# Altium project NG2092_R0M0E0.PrjPcb (part 6 of 8)

## Sheet NG2092_LEVEL_SHIFT.SchDoc: =project_title
size Tabloid; CompanyName: Luxonis Holding; DrawnBy: Nejc Gostincar; Organization: Luxonis Holding; Address1: 1925 Harmony Park Drive; Address2: Westminster, CO; Address3: 80234; Address4: United States; DocumentNumber: DXXXX; Revision: R0M0E0; SheetNumber: 12; SheetTotal: 12
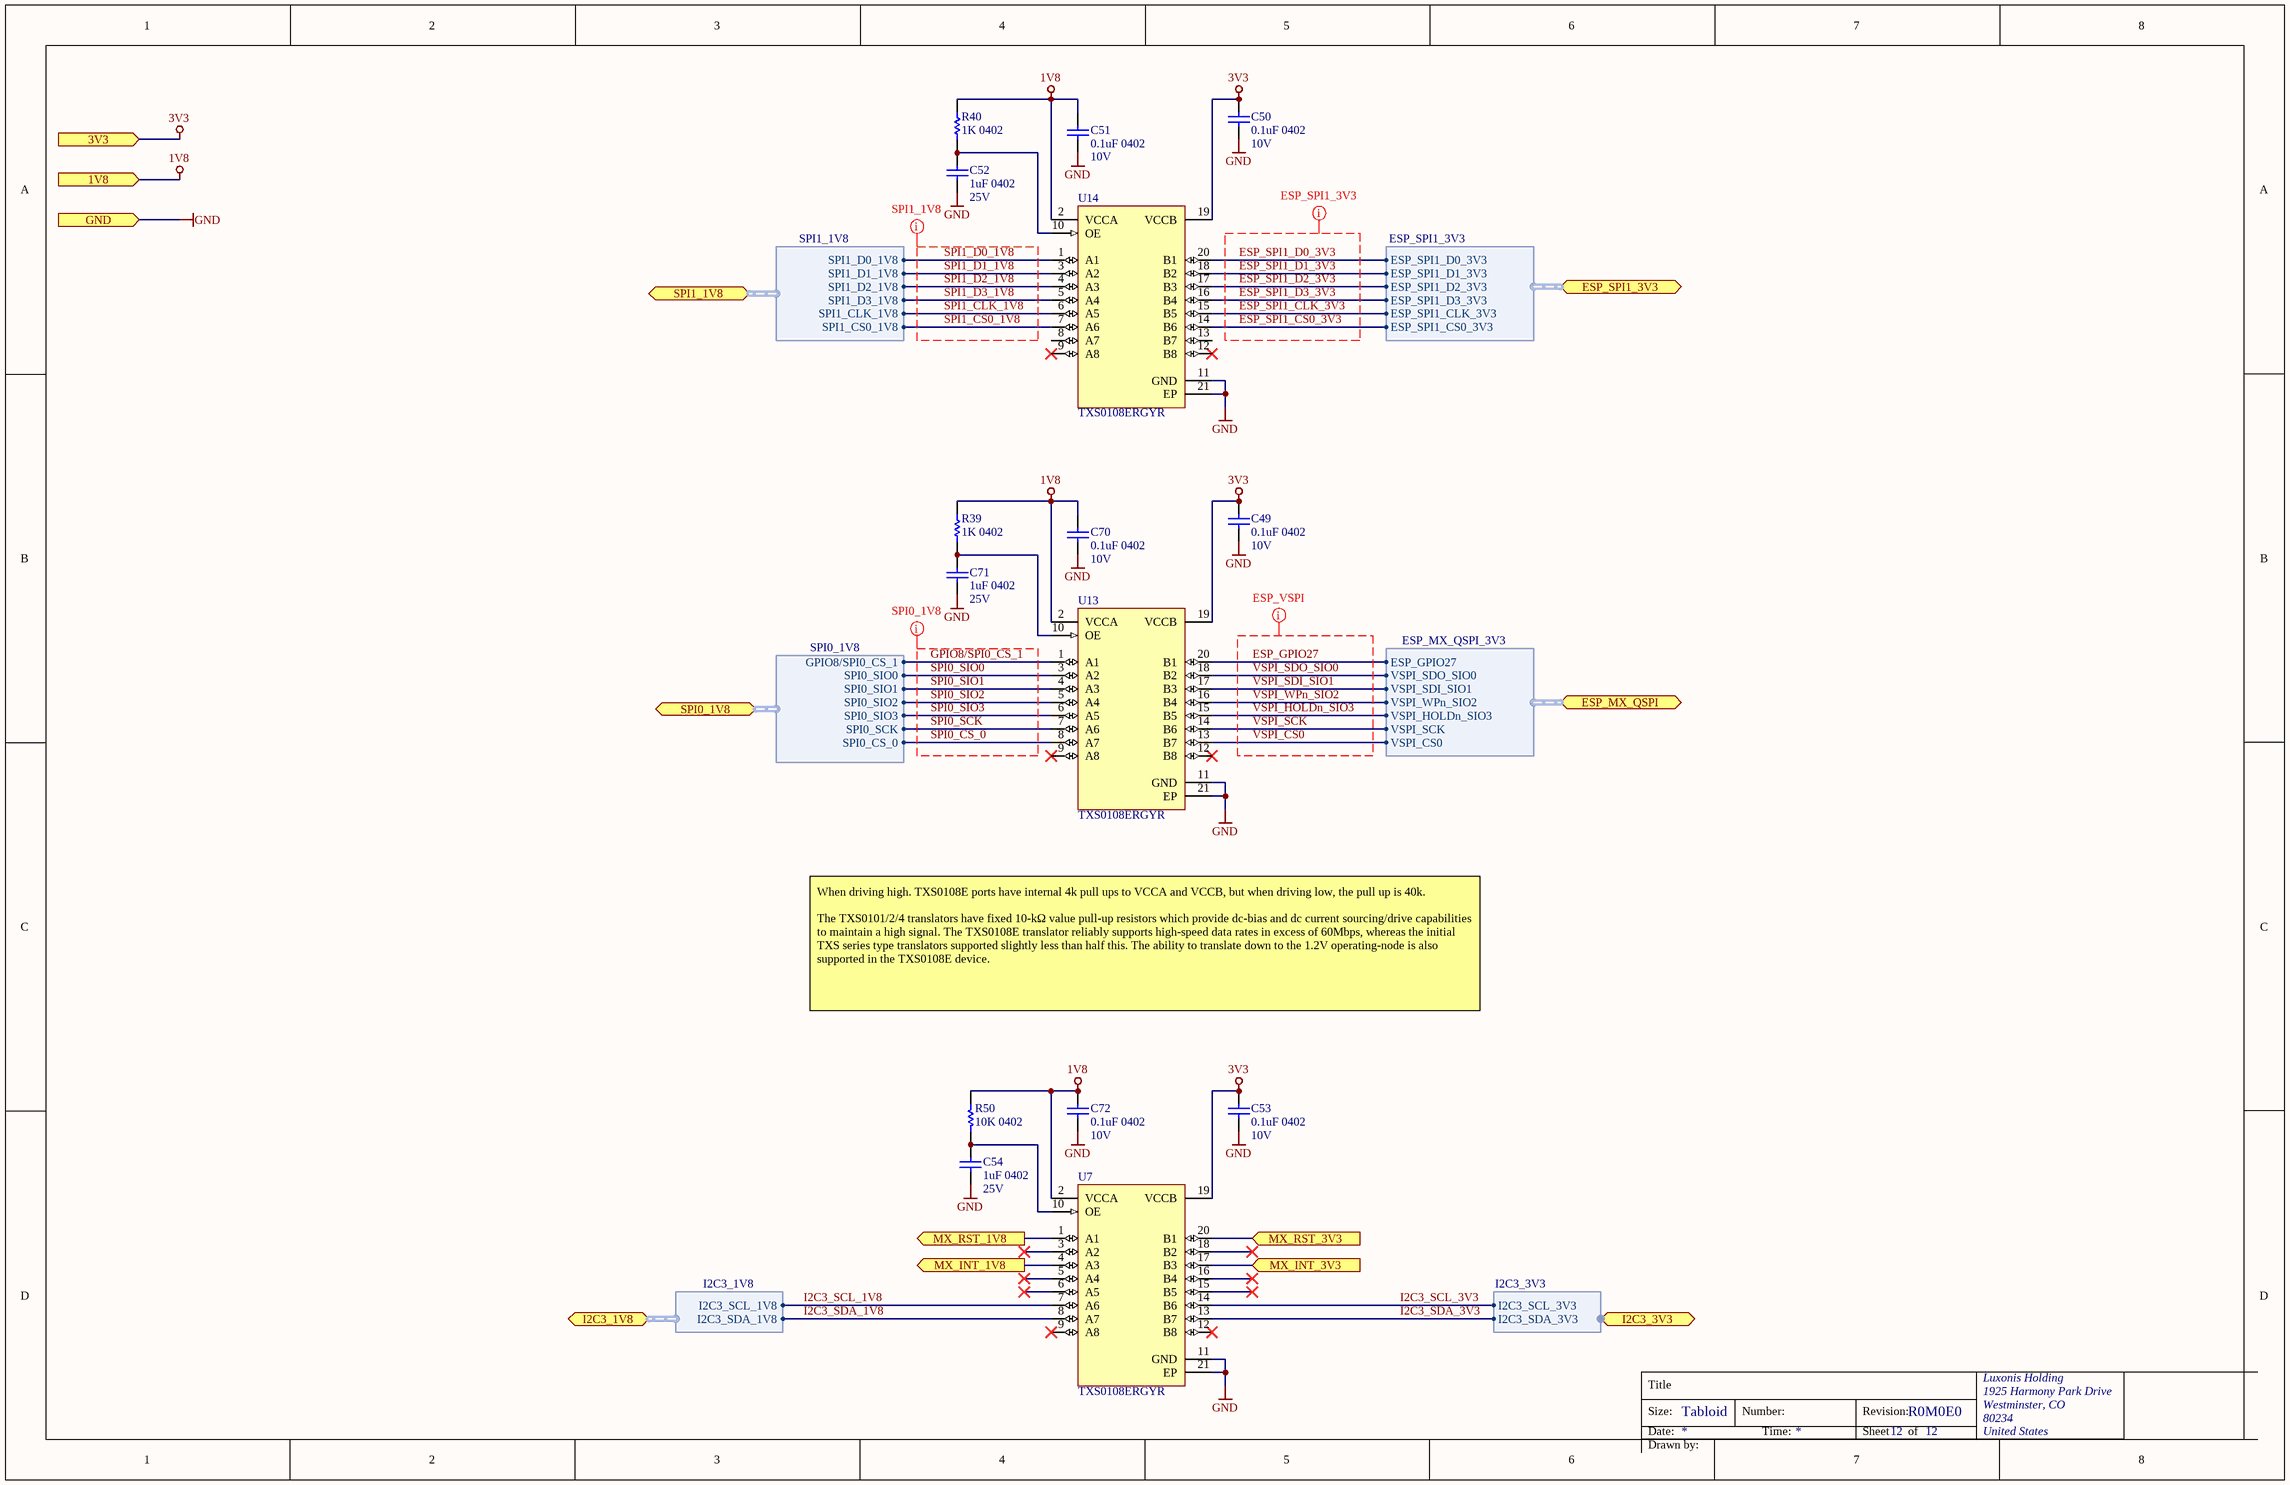
[diagram p11: NG2092_LEVEL_SHIFT.SchDoc]

### Parts
C49  0.1uF 0402  Voltage Rating: 10V  [CAPC0402(1005)70_L]
C50  0.1uF 0402  Voltage Rating: 10V  [CAPC0402(1005)70_L]
C51  0.1uF 0402  Voltage Rating: 10V  [CAPC0402(1005)70_L]
C52  1uF 0402  Voltage Rating: 25V  [CAPC0402(1005)70_N]
C53  0.1uF 0402  Voltage Rating: 10V  [CAPC0402(1005)70_L]
C54  1uF 0402  Voltage Rating: 25V  [CAPC0402(1005)70_N]
C70  0.1uF 0402  Voltage Rating: 10V  [CAPC0402(1005)70_L]
C71  1uF 0402  Voltage Rating: 25V  [CAPC0402(1005)70_N]
C72  0.1uF 0402  Voltage Rating: 10V  [CAPC0402(1005)70_L]
R39  1K 0402  [RESC0402(1005)_L]
R40  1K 0402  [RESC0402(1005)_L]
R50  10K 0402  [RESC0402(1005)_L]
U7  TXS0108ERGYR  [TXS0108ERGYR]
U13  TXS0108ERGYR  [TXS0108ERGYR]
U14  TXS0108ERGYR  [TXS0108ERGYR]

### Ports
1V8 (in), 3V3 (in), ESP_MX_QSPI (bidir, harness ESP_MX_QSPI_3V3), ESP_SPI1_3V3 (bidir, harness ESP_SPI1_3V3), GND (in), I2C3_1V8 (bidir, harness I2C3_1V8), I2C3_3V3 (bidir, harness I2C3_3V3), MX_INT_1V8 (out), MX_INT_3V3 (in), MX_RST_1V8 (out), MX_RST_3V3 (in), SPI0_1V8 (bidir, harness SPI0_1V8), SPI1_1V8 (bidir, harness SPI1_1V8)

### Harnesses
I2C3_3V3: I2C3_SCL_3V3, I2C3_SDA_3V3
ESP_MX_QSPI_3V3: VSPI_CS0, VSPI_HOLDn_SIO3, VSPI_SCK, VSPI_SDI_SIO1, VSPI_SDO_SIO0, VSPI_WPn_SIO2, ESP_GPIO27
SPI0_1V8: SPI0_SIO1, SPI0_SIO2, SPI0_SIO3, GPIO8/SPI0_CS_1, SPI0_SIO0, SPI0_CS_0, SPI0_SCK
I2C3_1V8: I2C3_SCL_1V8, I2C3_SDA_1V8
ESP_SPI1_3V3: ESP_SPI1_D0_3V3, ESP_SPI1_D1_3V3, ESP_SPI1_D2_3V3, ESP_SPI1_D3_3V3, ESP_SPI1_CLK_3V3, ESP_SPI1_CS0_3V3
SPI1_1V8: SPI1_D0_1V8, SPI1_D1_1V8, SPI1_D2_1V8, SPI1_D3_1V8, SPI1_CLK_1V8, SPI1_CS0_1V8

### Nets
1V8: C51.2 C70.2 C72.2 R39.2 R40.2 R50.1 U7.2(VCCA) U13.2(VCCA) U14.2(VCCA) ; port 1V8
3V3: C49.2 C50.2 C53.2 U7.19(VCCB) U13.19(VCCB) U14.19(VCCB) ; port 3V3
GND: C49.1 C50.1 C51.1 C52.1 C53.1 C54.1 C70.1 C71.1 C72.1 U7.11(GND) U7.21(EP) U13.11(GND) U13.21(EP) U14.11(GND) U14.21(EP) ; port GND
ESP_GPIO27: U13.20(B1) ; port ESP_MX_QSPI.ESP_GPIO27
ESP_SPI1_CLK_3V3: U14.15(B5) ; port ESP_SPI1_3V3.ESP_SPI1_CLK_3V3  [project net ESP_GPIO14_CLK]
ESP_SPI1_CS0_3V3: U14.14(B6) ; port ESP_SPI1_3V3.ESP_SPI1_CS0_3V3  [project net ESP_GPIO15_CS0]
ESP_SPI1_D0_3V3: U14.20(B1) ; port ESP_SPI1_3V3.ESP_SPI1_D0_3V3  [project net ESP_GPIO2_D0]
ESP_SPI1_D1_3V3: U14.18(B2) ; port ESP_SPI1_3V3.ESP_SPI1_D1_3V3  [project net ESP_GPIO4_D1]
ESP_SPI1_D2_3V3: U14.17(B3) ; port ESP_SPI1_3V3.ESP_SPI1_D2_3V3  [project net ESP_GPIO12_D2]
ESP_SPI1_D3_3V3: U14.16(B4) ; port ESP_SPI1_3V3.ESP_SPI1_D3_3V3  [project net ESP_GPIO13_D3]
GPIO8/SPI0_CS_1: U13.1(A1) ; port SPI0_1V8.GPIO8/SPI0_CS_1
I2C3_SCL_1V8: U7.7(A6) ; port I2C3_1V8.I2C3_SCL_1V8
I2C3_SCL_3V3: U7.14(B6) ; port I2C3_3V3.I2C3_SCL_3V3
I2C3_SDA_1V8: U7.8(A7) ; port I2C3_1V8.I2C3_SDA_1V8
I2C3_SDA_3V3: U7.13(B7) ; port I2C3_3V3.I2C3_SDA_3V3
MX_INT_1V8: U7.4(A3) ; port MX_INT_1V8
MX_INT_3V3: U7.17(B3) ; port MX_INT_3V3
MX_RST_1V8: U7.1(A1) ; port MX_RST_1V8
MX_RST_3V3: U7.20(B1) ; port MX_RST_3V3
SPI0_CS_0: U13.8(A7) ; port SPI0_1V8.SPI0_CS_0
SPI0_SCK: U13.7(A6) ; port SPI0_1V8.SPI0_SCK
SPI0_SIO0: U13.3(A2) ; port SPI0_1V8.SPI0_SIO0
SPI0_SIO1: U13.4(A3) ; port SPI0_1V8.SPI0_SIO1
SPI0_SIO2: U13.5(A4) ; port SPI0_1V8.SPI0_SIO2
SPI0_SIO3: U13.6(A5) ; port SPI0_1V8.SPI0_SIO3
SPI1_CLK_1V8: U14.6(A5) ; port SPI1_1V8.SPI1_CLK_1V8
SPI1_CS0_1V8: U14.7(A6) ; port SPI1_1V8.SPI1_CS0_1V8
SPI1_D0_1V8: U14.1(A1) ; port SPI1_1V8.SPI1_D0_1V8
SPI1_D1_1V8: U14.3(A2) ; port SPI1_1V8.SPI1_D1_1V8
SPI1_D2_1V8: U14.4(A3) ; port SPI1_1V8.SPI1_D2_1V8
SPI1_D3_1V8: U14.5(A4) ; port SPI1_1V8.SPI1_D3_1V8
VSPI_CS0: U13.13(B7) ; port ESP_MX_QSPI.VSPI_CS0
VSPI_HOLDn_SIO3: U13.15(B5) ; port ESP_MX_QSPI.VSPI_HOLDn_SIO3
VSPI_SCK: U13.14(B6) ; port ESP_MX_QSPI.VSPI_SCK
VSPI_SDI_SIO1: U13.17(B3) ; port ESP_MX_QSPI.VSPI_SDI_SIO1
VSPI_SDO_SIO0: U13.18(B2) ; port ESP_MX_QSPI.VSPI_SDO_SIO0
VSPI_WPn_SIO2: U13.16(B4) ; port ESP_MX_QSPI.VSPI_WPn_SIO2
NetC52_2: C52.2 R40.1 U14.10(OE)
NetC54_2: C54.2 R50.2 U7.10(OE)
NetC71_2: C71.2 R39.1 U13.10(OE)

Not connected (* = marked no-connect by the designer): U7 3(A2)* 5(A4)* 6(A5)* 9(A8)* 12(B8)* 15(B5)* 16(B4)* 18(B2)*; U13 9(A8)* 12(B8)*; U14 8(A7) 9(A8)* 12(B8)* 13(B7)

### Layout directives
net class ESP_VSPI: ESP_GPIO27, VSPI_CS0, VSPI_HOLDn_SIO3, VSPI_SCK, VSPI_SDI_SIO1, VSPI_SDO_SIO0, VSPI_WPn_SIO2
net class ESP_SPI1_3V3: ESP_SPI1_CLK_3V3, ESP_SPI1_CS0_3V3, ESP_SPI1_D0_3V3, ESP_SPI1_D1_3V3, ESP_SPI1_D2_3V3, ESP_SPI1_D3_3V3
net class SPI1_1V8: SPI1_CLK_1V8, SPI1_CS0_1V8, SPI1_D0_1V8, SPI1_D1_1V8, SPI1_D2_1V8, SPI1_D3_1V8
net class SPI0_1V8: GPIO8/SPI0_CS_1, SPI0_CS_0, SPI0_SCK, SPI0_SIO0, SPI0_SIO1, SPI0_SIO2, SPI0_SIO3

### Notes on the sheet
- When driving high. TXS0108E ports have internal 4k pull ups to VCCA and VCCB, but when driving low, the pull up is 40k.
  The TXS0101/2/4 translators have fixed 10-kΩ value pull-up resistors which provide dc-bias and dc current sourcing/drive capabilities to maintain a high signal. The TXS0108E translator reliably supports high-speed data rates in excess of 60Mbps, whereas the initial TXS series type translators supported slightly less than half this. The ability to translate down to the 1.2V operating-node is also supported in the TXS0108E device.
- Title
- Size:
- Date:
- Tabloid
- Number:
- Time:
- Revision:
- Sheet
- of
- Drawn by:

### Library data of the parts
C49-C51 C53 C70 C72 = GRM155R71A104JA01D: CAP CER 0.1UF 10V X7R 0402 5%; Manufacturer 1: Murata; Capacitance: 100nF; Supplier 1: Digi-Key; Manufacturer Part Number 1: GRM155R71A104JA01D; Stock 1: 1346709; Pricing 1: 1=0.10000, 10=0.02500, 100=0.01130, 500=0.00806, 1000=0.00633, 2500=0.00575, 5000=0.00529 (USD); RoHS: Yes; Mount: Surface Mount; Case/Package: 0402; Case Code (Imperial): 0402; Case Code (Metric): 1005; Min Operating Temperature: -55°C; Max Operating Temperature: 125°C; Tolerance: 5%; Packaging: Tape and Reel; Voltage Rating (DC): 10V; Dielectric: X7R; Package Quantity: 10000; Termination: SMD/SMT; Length: 1mm; Height: 0.5mm; Width: 0.02inch; Thickness: 0.022inch; Depth: 0.5mm; Radiation Hardening: No; Lead Free: Lead Free; ComponentLink1URL: https://datasheet.ciiva.com/5411/product-5411135.pdf?src-supplier=Mouser; ComponentLink1Description: https://datasheet.ciiva.com/5411/product-5411135.pdf?src-supplier=Mouser; ComponentLink2URL: https://datasheet.ciiva.com/11618/c02e-11618821.pdf?src-supplier=Avnet; ComponentLink2Description: https://datasheet.ciiva.com/11618/c02e-11618821.pdf?src-supplier=Avnet; Supplier Part Number 1: 490-10777-1-ND
C52 C54 C71 = GRM155R61E105KA12D: CAP CER 1UF 25V X5R 0402 10%; Manufacturer 1: Murata; Material: Ceramic; Supplier 1: Digi-Key; Manufacturer Part Number 1: GRM155R61E105KA12D; Stock 1: 200653; Pricing 1: 1=0.10000, 10=0.07100, 100=0.03350, 500=0.02352, 1000=0.01947, 2500=0.01812, 5000=0.01658 (USD); RoHS: Yes; Mount: Surface Mount; Case/Package: 0402; Weight: 0.000212oz; Case Code (Metric): 1005; Case Code (Imperial): 0402; Min Operating Temperature: -55°C; Max Operating Temperature: 85°C; Tolerance: 10%; Capacitance: 1uF; Dielectric: X5R; Voltage Rating (DC): 25V; Packaging: Tape and Reel; Package Quantity: 10000; Termination: SMD/SMT; Voltage: 25V; Length: 1mm; Height: 0.5mm; Width: 0.5mm; Thickness: 0.022inch; Depth: 0.5mm; Lead Free: Lead Free; REACH SVHC: No SVHC; ComponentLink1URL: https://datasheet.ciiva.com/22732/1666664-22732122.pdf?src-supplier=Element14; ComponentLink1Description: https://datasheet.ciiva.com/22732/1666664-22732122.pdf?src-supplier=Element14; ComponentLink2URL: https://datasheet.ciiva.com/7719/1666664-7719006.pdf?src-supplier=Element14; ComponentLink2Description: https://datasheet.ciiva.com/7719/1666664-7719006.pdf?src-supplier=Element14; Supplier Part Number 1: 490-10017-1-ND; Supplier 2: Arrow; Supplier 3: TTI; Supplier Part Number 2: GRM155R61E105KA12D; Supplier Part Number 3: GRM155R61E105KA12D
R39 R40 = RC0402FR-071KL: RES SMD 1K OHM 1% 1/16W 0402; Manufacturer 1: Yageo; Temperature Coefficient: 100ppm/°C; Power Rating: 62.5mW; Voltage Rating (DC): 50V; Resistance: 1kR; RoHS: Yes; Number of Pins: 2; Case Code (Imperial): 0402; Case Code (Metric): 1005; Min Operating Temperature: -55°C; Max Operating Temperature: 155°C; Packaging: Tape and Reel; Composition: Thick Film; Voltage Rating: 50V; Military Standard: Not; Termination: SMD/SMT; Length: 1mm; Height: 0.32mm; Width: 0.5mm; Depth: 0.5mm; Lead Free: Lead Free; REACH SVHC: Unknown; ComponentLink1URL: https://datasheet.ciiva.com/11819/0900766b80c66297-11819477.pdf?src-supplier=RSComponents; ComponentLink1Description: https://datasheet.ciiva.com/11819/0900766b80c66297-11819477.pdf?src-supplier=RSComponents; ComponentLink2URL: https://datasheet.ciiva.com/12666/pyu-rc0402-51-rohs-l-6-r-12666741.pdf?src-supplier=Mouser; ComponentLink2Description: https://datasheet.ciiva.com/12666/pyu-rc0402-51-rohs-l-6-r-12666741.pdf?src-supplier=Mouser; ComponentLink3URL: https://datasheet.ciiva.com/17063/pyu-rc0402-51-rohs-l-6-r-17063193.pdf?src-supplier=Future+Electronics; ComponentLink3Description: https://datasheet.ciiva.com/17063/pyu-rc0402-51-rohs-l-6-r-17063193.pdf?src-supplier=Future+Electronics; ComponentLink4URL: https://datasheet.ciiva.com/22747/1018594-22747513.pdf?src-supplier=Element14; ComponentLink4Description: https://datasheet.ciiva.com/22747/1018594-22747513.pdf?src-supplier=Element14; ComponentLink5URL: https://datasheet.ciiva.com/7849/1018594-7849869.pdf?src-supplier=Element14; ComponentLink5Description: https://datasheet.ciiva.com/7849/1018594-7849869.pdf?src-supplier=Element14; ComponentLink6URL: https://datasheet.ciiva.com/7983/1018594-7983502.pdf?src-supplier=Element14; ComponentLink6Description: https://datasheet.ciiva.com/7983/1018594-7983502.pdf?src-supplier=Element14; ComponentLink7URL: https://datasheet.ciiva.com/7849/1018594-7849871.pdf?src-supplier=Element14; ComponentLink7Description: https://datasheet.ciiva.com/7849/1018594-7849871.pdf?src-supplier=Element14; Supplier 1: Digi-Key; Manufacturer Part Number 1: RC0402FR-071KL; Stock 1: 60695854; Pricing 1: 1=0.10000, 10=0.01600, 100=0.00670, 1000=0.00301, 2500=0.00261, 5000=0.00215 (USD); Case/Package: 0402; Tolerance: 1%; Supplier Part Number 1: 311-1.00KLRCT-ND
R50 = RC0402FR-1310KL: as R11-R14 on sheet NG2092_USB; ComponentLink1URL: https://datasheet.ciiva.com/16940/pyu-rc0402-51-rohs-l-6-16940293.pdf?src-supplier=Avnet+Europe; ComponentLink1Description: https://datasheet.ciiva.com/16940/pyu-rc0402-51-rohs-l-6-16940293.pdf?src-supplier=Avnet+Europe; ComponentLink2URL: https://datasheet.ciiva.com/28386/pyu-rc0402-51-rohs-l-6-28386855.pdf?src-supplier=Avnet+Europe; ComponentLink2Description: https://datasheet.ciiva.com/28386/pyu-rc0402-51-rohs-l-6-28386855.pdf?src-supplier=Avnet+Europe; ComponentLink3URL: https://datasheet.ciiva.com/16740/pyu-rc0402-51-rohs-l-6-r-16740602.pdf?src-supplier=Future+Electronics; ComponentLink3Description: https://datasheet.ciiva.com/16740/pyu-rc0402-51-rohs-l-6-r-16740602.pdf?src-supplier=Future+Electronics; ComponentLink4URL: https://datasheet.ciiva.com/8891/pyu-rc0402-51-rohs-l-6-8891339.pdf?src-supplier=Avnet; ComponentLink4Description: https://datasheet.ciiva.com/8891/pyu-rc0402-51-rohs-l-6-8891339.pdf?src-supplier=Avnet; ComponentLink5URL: https://datasheet.ciiva.com/5557/pyu-rc0402-51-rohs-l-6-r-5557997.pdf?src-supplier=Mouser; ComponentLink5Description: https://datasheet.ciiva.com/5557/pyu-rc0402-51-rohs-l-6-r-5557997.pdf?src-supplier=Mouser; ComponentLink6URL: https://datasheet.ciiva.com/7983/1018594-7983533.pdf?src-supplier=Element14; ComponentLink6Description: https://datasheet.ciiva.com/7983/1018594-7983533.pdf?src-supplier=Element14; Supplier 1: Newark; Manufacturer Part Number 1: RC0402FR-1310KL; Stock 1: 62239; Pricing 1: 1=0.10000, 25=0.01200, 100=0.00400, 250=0.00400, 500=0.00300, 1000=0.00300 (USD); RoHS: Yes; Case/Package: 0402; Number of Pins: 2; Contact Plating: Tin,Matte,Lead; Case Code (Imperial): 0402; Case Code (Metric): 1005; Min Operating Temperature: -55°C; Max Operating Temperature: 155°C; Tolerance: 1%; Composition: Thick Film; Packaging: Tape and Reel; Termination: SMD/SMT; Military Standard: Not; Voltage Rating (DC): 50V; Working Voltage: 50V; Number of Terminations: 2; Length: 1mm; Depth: 0.5mm; Radiation Hardening: No; REACH SVHC: No SVHC; Lead Free: Lead Free; Supplier Part Number 1: 67R9960; Supplier 2: Future Electronics; Supplier 3: Mouser; Supplier 4: Element14; Supplier Part Number 2: RC0402FR-1310KL-CUTT; Supplier Part Number 3: 603-RC0402FR-1310KL; Supplier Part Number 4: 1799235
U7 U13 U14 = TXS0108ERGYR: IC TRNSLTR BIDIRECTIONAL 20VQFN; Manufacturer 1: Texas Instruments; Logic Function: Translator; Number of Bits: 8; Turn-On Delay Time: 312ns; High Level Output Current: -50mA; Low Level Output Current: 50mA; Quiescent Current: 3uA; Propagation Delay: 4.8ns; Min Supply Voltage: 1.2V; Max Supply Voltage: 5.5V; Data Rate: 60Mbps; Output Type: Voltage; Supplier 1: Digi-Key; Manufacturer Part Number 1: TXS0108ERGYR; RoHS: Yes; Category: Integrated Circuits (ICs); Stock 1: 122729; Pricing 1: 1=1.42000, 10=1.26600, 25=1.20120, 100=0.98670, 250=0.92236, 500=0.81510, 1000=0.64350 (USD); Mount: Surface Mount; Case/Package: VQFN; Number of Pins: 20; Weight: 0.001517oz; Min Operating Temperature: -40°C; Max Operating Temperature: 85°C; Number of Inputs: 8; Packaging: Tape and Reel; Package Quantity: 1; Number of Channels: 8; Radiation Hardening: No; Lead Free: Lead Free; REACH SVHC: No SVHC; ComponentLink1URL: https://datasheet.ciiva.com/15096/getdatasheetpartid-189651-15096225.pdf?src-supplier=Verical; ComponentLink1Description: https://datasheet.ciiva.com/15096/getdatasheetpartid-189651-15096225.pdf?src-supplier=Verical; ComponentLink2URL: https://datasheet.ciiva.com/22659/1718976-22659572.pdf?src-supplier=Element14; ComponentLink2Description: https://datasheet.ciiva.com/22659/1718976-22659572.pdf?src-supplier=Element14; ComponentLink3URL: https://datasheet.ciiva.com/26185/txs0108e-26185177.pdf?src-supplier=Avnet+Europe; ComponentLink3Description: https://datasheet.ciiva.com/26185/txs0108e-26185177.pdf?src-supplier=Avnet+Europe; ComponentLink4URL: https://datasheet.ciiva.com/14287/txs0108e-14287692.pdf?src-supplier=Avnet; ComponentLink4Description: https://datasheet.ciiva.com/14287/txs0108e-14287692.pdf?src-supplier=Avnet; ComponentLink5URL: https://datasheet.ciiva.com/1899/txs0108e-1899610.pdf?src-supplier=Digi-Key; ComponentLink5Description: https://datasheet.ciiva.com/1899/txs0108e-1899610.pdf?src-supplier=Digi-Key; ComponentLink6URL: https://datasheet.ciiva.com/1899/txs0108e-1899611.pdf?src-supplier=Digi-Key; ComponentLink6Description: https://datasheet.ciiva.com/1899/txs0108e-1899611.pdf?src-supplier=Digi-Key; ComponentLink7URL: https://datasheet.ciiva.com/1899/txs0108e-1899612.pdf?src-supplier=Digi-Key; ComponentLink7Description: https://datasheet.ciiva.com/1899/txs0108e-1899612.pdf?src-supplier=Digi-Key; ComponentLink8URL: https://datasheet.ciiva.com/14287/txs0108e-14287533.pdf?src-supplier=Avnet; ComponentLink8Description: https://datasheet.ciiva.com/14287/txs0108e-14287533.pdf?src-supplier=Avnet; ComponentLink9URL: https://datasheet.ciiva.com/48701/001073880-da-01-en-ic-xlatr-volt-lv-txs0108ergyr-qfn-20-tid-48701964.pdf?src-supplier=Conrad; ComponentLink9Description: https://datasheet.ciiva.com/48701/001073880-da-01-en-ic-xlatr-volt-lv-txs0108ergyr-qfn-20-tid-48701964.pdf?src-supplier=Conrad; Supplier 2: Digi-Key; Supplier 3: Arrow; Supplier 4: TI store; Supplier 5: Mouser; Supplier Part Number 1: 296-24806-1-ND; Supplier Part Number 2: 296-24806-2-ND; Supplier Part Number 3: TXS0108ERGYR; Supplier Part Number 4: TXS0108ERGYR; Supplier Part Number 5: 595-TXS0108ERGYR

## Sheet NG2092_Connector_B.SchDoc: =project_title
size Tabloid; CompanyName: Luxonis Holding; DrawnBy: Nejc Gostincar; Organization: Luxonis Holding; Address1: 1925 Harmony Park Drive; Address2: Westminster, CO; Address3: 80234; Address4: United States; DocumentNumber: DXXXX; Revision: R0M0E0; SheetNumber: 3; SheetTotal: 12
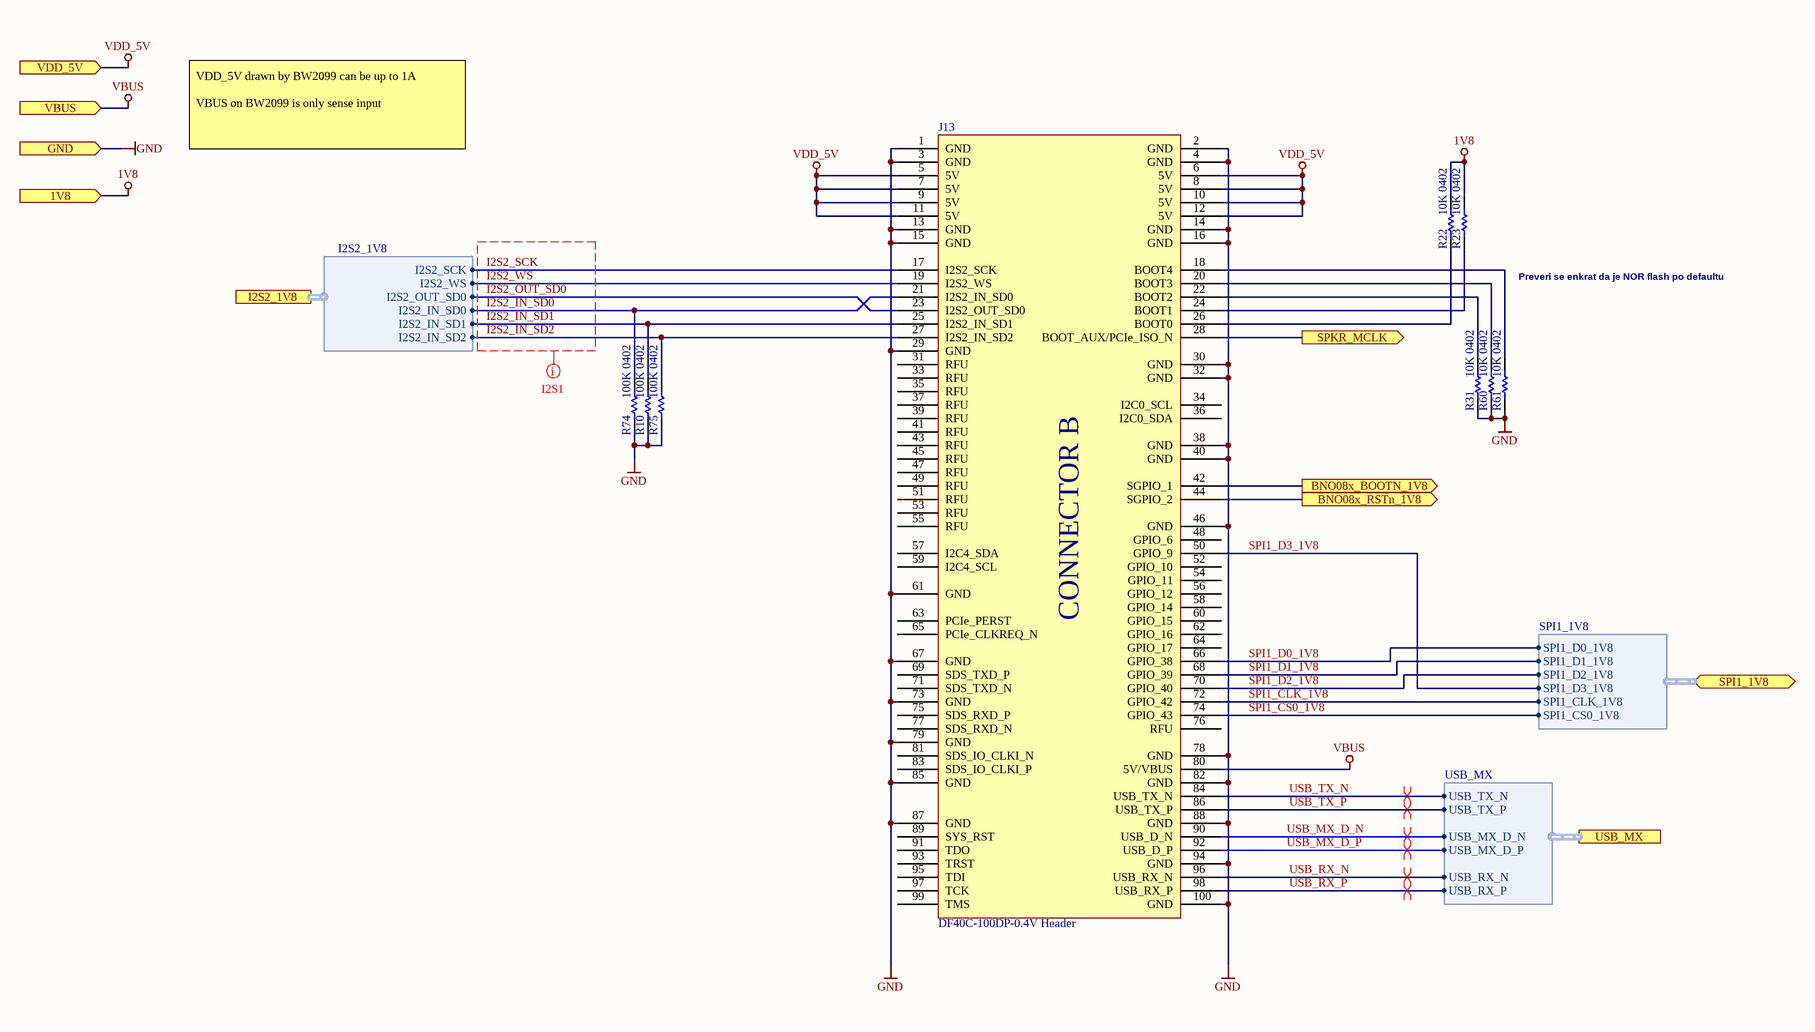
[diagram p12: NG2092_Connector_B.SchDoc]

### Parts
J13  DF40C-100DP-0.4V Header  [CON_BW2099_B]
R10  100K 0402  [RESC0402(1005)_L]
R22  10K 0402  [RESC0402(1005)_L]
R23  10K 0402  [RESC0402(1005)_L]
R31  10K 0402  [RESC0402(1005)_L]
R60  10K 0402  [RESC0402(1005)_L]
R61  10K 0402  [RESC0402(1005)_L]
R74  100K 0402  [RESC0402(1005)_L]
R75  100K 0402  [RESC0402(1005)_L]

### Ports
1V8 (in), BNO08x_BOOTN_1V8 (out), BNO08x_RSTn_1V8 (out), GND (in), I2S2_1V8 (harness I2S2_1V8), SPI1_1V8 (bidir, harness SPI1_1V8), SPKR_MCLK (out), USB_MX (harness USB_MX), VBUS (in), VDD_5V (in)

### Harnesses
USB_MX: USB_MX_D_P, USB_MX_D_N, USB_TX_N, USB_TX_P, USB_RX_N, USB_RX_P
I2S2_1V8: I2S2_SCK, I2S2_WS, I2S2_OUT_SD0, I2S2_IN_SD0, I2S2_IN_SD1, I2S2_IN_SD2
SPI1_1V8: SPI1_D0_1V8, SPI1_D1_1V8, SPI1_D2_1V8, SPI1_D3_1V8, SPI1_CLK_1V8, SPI1_CS0_1V8

### Nets
1V8: R22.2 R23.2 ; port 1V8
GND: J13.1(GND) J13.2(GND) J13.3(GND) J13.4(GND) J13.13(GND) J13.14(GND) J13.15(GND) J13.16(GND) J13.29(GND) J13.30(GND) J13.32(GND) J13.38(GND) J13.40(GND) J13.46(GND) J13.61(GND) J13.67(GND) J13.73(GND) J13.78(GND) J13.79(GND) J13.82(GND) J13.85(GND) J13.87(GND) J13.88(GND) J13.94(GND) J13.100(GND) R10.2 R31.1 R60.1 R61.1 R74.2 R75.2 ; port GND
VBUS: J13.80(5V/VBUS) ; port VBUS
VDD_5V: J13.5(5V) J13.6(5V) J13.7(5V) J13.8(5V) J13.9(5V) J13.10(5V) J13.11(5V) J13.12(5V) ; port VDD_5V
BNO08x_BOOTN_1V8: J13.42(SGPIO_1) ; port BNO08x_BOOTN_1V8
BNO08x_RSTn_1V8: J13.44(SGPIO_2) ; port BNO08x_RSTn_1V8
I2S2_IN_SD0: J13.21(I2S2_IN_SD0) R74.1 ; port I2S2_1V8.I2S2_IN_SD0
I2S2_IN_SD1: J13.25(I2S2_IN_SD1) R10.1 ; port I2S2_1V8.I2S2_IN_SD1
I2S2_IN_SD2: J13.27(I2S2_IN_SD2) R75.1 ; port I2S2_1V8.I2S2_IN_SD2
I2S2_OUT_SD0: J13.23(I2S2_OUT_SD0) ; port I2S2_1V8.I2S2_OUT_SD0
I2S2_SCK: J13.17(I2S2_SCK) ; port I2S2_1V8.I2S2_SCK
I2S2_WS: J13.19(I2S2_WS) ; port I2S2_1V8.I2S2_WS
SPI1_CLK_1V8: J13.72(GPIO_42) ; port SPI1_1V8.SPI1_CLK_1V8
SPI1_CS0_1V8: J13.74(GPIO_43) ; port SPI1_1V8.SPI1_CS0_1V8
SPI1_D0_1V8: J13.66(GPIO_38) ; port SPI1_1V8.SPI1_D0_1V8
SPI1_D1_1V8: J13.68(GPIO_39) ; port SPI1_1V8.SPI1_D1_1V8
SPI1_D2_1V8: J13.70(GPIO_40) ; port SPI1_1V8.SPI1_D2_1V8
SPI1_D3_1V8: J13.50(GPIO_9) ; port SPI1_1V8.SPI1_D3_1V8
SPKR_MCLK: J13.28(BOOT_AUX/PCIe_ISO_N) ; port SPKR_MCLK
USB_MX_D_N: J13.90(USB_D_N) ; port USB_MX.USB_MX_D_N
USB_MX_D_P: J13.92(USB_D_P) ; port USB_MX.USB_MX_D_P
USB_RX_N: J13.96(USB_RX_N) ; port USB_MX.USB_RX_N
USB_RX_P: J13.98(USB_RX_P) ; port USB_MX.USB_RX_P
USB_TX_N: J13.84(USB_TX_N) ; port USB_MX.USB_TX_N
USB_TX_P: J13.86(USB_TX_P) ; port USB_MX.USB_TX_P
NetJ13_18: J13.18(BOOT4) R61.2
NetJ13_20: J13.20(BOOT3) R60.2
NetJ13_22: J13.22(BOOT2) R31.2
NetJ13_24: J13.24(BOOT1) R23.1
NetJ13_26: J13.26(BOOT0) R22.1

Not connected (* = marked no-connect by the designer): J13 31(RFU) 33(RFU) 34(I2C0_SCL) 35(RFU) 36(I2C0_SDA) 37(RFU) 39(RFU) 41(RFU) 43(RFU) 45(RFU) 47(RFU) 48(GPIO_6) 49(RFU) 51(RFU) 52(GPIO_10) 53(RFU) 54(GPIO_11) 55(RFU) 56(GPIO_12) 57(I2C4_SDA) 58(GPIO_14) 59(I2C4_SCL) 60(GPIO_15) 62(GPIO_16) 63(PCIe_PERST) 64(GPIO_17) 65(PCIe_CLKREQ_N) 69(SDS_TXD_P) 71(SDS_TXD_N) 75(SDS_RXD_P) 76(RFU) 77(SDS_RXD_N) 81(SDS_IO_CLKI_N) 83(SDS_IO_CLKI_P) 89(SYS_RST) 91(TDO) 93(TRST) 95(TDI) 97(TCK) 99(TMS)

### Layout directives
differential pair; differential pair class 90ohm: USB_MX_D_N, USB_MX_D_P, USB_RX_N, USB_RX_P, USB_TX_N, USB_TX_P
net class I2S1: I2S2_IN_SD0, I2S2_IN_SD1, I2S2_IN_SD2, I2S2_OUT_SD0, I2S2_SCK, I2S2_WS

### Notes on the sheet
- VDD_5V drawn by BW2099 can be up to 1A
  VBUS on BW2099 is only sense input
- Preveri se enkrat da je NOR flash po defaultu
- Title
- Size:
- Date:
- Tabloid
- Number:
- Time:
- Revision:
- Sheet
- of
- Drawn by:
- (in symbol DF40C-100DP-0.4V_BW2099_B) CONNECTOR B

### Library data of the parts
J13 = DF40C-100DP-0.4V_BW2099_B: CONN HDR 100POS 0.4MM SMD GOLD BW2099 SYMBOL; Manufacturer 1: Hirose; Manufacturer Part Number 1: DF40HC(3.0)-100DS-0.4V(51; pin_current: 0.3A; Voltage Rating: 30V; Connector Type: Receptacle; Number of Positions: 100; Stack Height: 1.5mm; pin_pitch: 0.4mm; mfg_pn: DF40C-100DP-0.4V; Supplier 1: Digi-Key; Stock 1: 2172; Pricing 1: 1=2.54000, 10=2.26000, 25=2.07000, 50=2.07000, 100=1.98000, 250=1.79000, 500=1.65000, 1000=1.41000, 3000=1.32000, 6000=1.23000, 10000=1.23000 (USD); RoHS: Yes; Mount: Surface Mount; Contact Plating: Gold; Min Operating Temperature: -35°C; Max Operating Temperature: 85°C; Number of Rows: 2; Termination: SMD/SMT; Package Quantity: 1000; Packaging: Tape and Reel; Orientation: Straight; Pitch: 0.4mm; Radiation Hardening: No; REACH SVHC: Unknown; Lead Free: Lead Free; ComponentLink1URL: https://datasheet.ciiva.com/46636/ed-df40-20140305-46636517.pdf?src-supplier=Digi-Key; ComponentLink1Description: https://datasheet.ciiva.com/46636/ed-df40-20140305-46636517.pdf?src-supplier=Digi-Key; ComponentLink2URL: https://datasheet.ciiva.com/18562/ed-df40-20140305-18562189.pdf?src-supplier=Digi-Key; ComponentLink2Description: https://datasheet.ciiva.com/18562/ed-df40-20140305-18562189.pdf?src-supplier=Digi-Key; ComponentLink3URL: https://datasheet.ciiva.com/13559/ed-df40-20140305-13559540.pdf?src-supplier=Mouser; ComponentLink3Description: https://datasheet.ciiva.com/13559/ed-df40-20140305-13559540.pdf?src-supplier=Mouser; ComponentLink4URL: https://datasheet.ciiva.com/18562/ed-df40-20140305-18562462.pdf?src-supplier=Digi-Key; ComponentLink4Description: https://datasheet.ciiva.com/18562/ed-df40-20140305-18562462.pdf?src-supplier=Digi-Key; Supplier Part Number 1: 798-DF40HC30100DS451; Supplier 2: Mouser; Supplier Part Number 2: 798-DF40HC30100DS458; Manufacturer 2: Hirose; Manufacturer Part Number 2: DF40HC(3.0)-100DS-0.4V(58)
R10 R74 R75 = RC0402FR-07100KL: RES SMD 100K OHM 1% 1/16W 0402; Manufacturer 1: Yageo; Power Rating: 63mW; Resistance: 100kR; Temperature Coefficient: 100ppm/°C; Voltage Rating: 50V; Supplier 1: Digi-Key; Manufacturer Part Number 1: RC0402FR-07100KL; Stock 1: 50867324; Pricing 1: 1=0.10000, 10=0.01500, 100=0.00600, 1000=0.00270, 2500=0.00235, 5000=0.00194 (USD); RoHS: Yes; Case/Package: 0402; Case Code (Metric): 1005; Case Code (Imperial): 0402; Min Operating Temperature: -55°C; Max Operating Temperature: 155°C; Tolerance: 1%; Packaging: Tape and Reel; Composition: Thick Film; Termination: SMD/SMT; Military Standard: Not; Package Quantity: 1; Number of Terminations: 2; Max Power Dissipation: 63mW; Features: Moisture Resistant; Working Voltage: 50V; Length: 0.039inch; Height: 0.016inch; Width: 0.02inch; Depth: 0.5mm; Lead Free: Lead Free; REACH SVHC: No SVHC; ComponentLink1URL: https://datasheet.ciiva.com/11819/0900766b80c66297-11819452.pdf?src-supplier=RSComponents; ComponentLink1Description: https://datasheet.ciiva.com/11819/0900766b80c66297-11819452.pdf?src-supplier=RSComponents; ComponentLink2URL: https://datasheet.ciiva.com/2453/pyu-r-int-thick-7-2453361.pdf?src-supplier=Digi-Key; ComponentLink2Description: https://datasheet.ciiva.com/2453/pyu-r-int-thick-7-2453361.pdf?src-supplier=Digi-Key; ComponentLink3URL: https://datasheet.ciiva.com/2453/pyu-r-int-thick-7-2453362.pdf?src-supplier=Digi-Key; ComponentLink3Description: https://datasheet.ciiva.com/2453/pyu-r-int-thick-7-2453362.pdf?src-supplier=Digi-Key; ComponentLink4URL: https://datasheet.ciiva.com/2453/pyu-r-int-thick-7-2453363.pdf?src-supplier=Digi-Key; ComponentLink4Description: https://datasheet.ciiva.com/2453/pyu-r-int-thick-7-2453363.pdf?src-supplier=Digi-Key; ComponentLink5URL: https://datasheet.ciiva.com/22747/1018594-22747509.pdf?src-supplier=Element14; ComponentLink5Description: https://datasheet.ciiva.com/22747/1018594-22747509.pdf?src-supplier=Element14; ComponentLink6URL: https://datasheet.ciiva.com/15189/getdatasheetpartid-323696-15189334.pdf?src-supplier=Verical; ComponentLink6Description: https://datasheet.ciiva.com/15189/getdatasheetpartid-323696-15189334.pdf?src-supplier=Verical; ComponentLink7URL: https://datasheet.ciiva.com/12667/pyu-rc0402-51-rohs-l-6-r-12667930.pdf?src-supplier=Mouser; ComponentLink7Description: https://datasheet.ciiva.com/12667/pyu-rc0402-51-rohs-l-6-r-12667930.pdf?src-supplier=Mouser; Supplier 2: Newark; Supplier 3: Mouser; Supplier Part Number 1: 311-100KLRCT-ND; Supplier Part Number 2: 67R9887; Supplier Part Number 3: 603-RC0402FR-07100KL
R22 R23 R31 R60 R61 = RC0402FR-1310KL: as R11-R14 on sheet NG2092_USB; ComponentLink1URL: https://datasheet.ciiva.com/16940/pyu-rc0402-51-rohs-l-6-16940293.pdf?src-supplier=Avnet+Europe; ComponentLink1Description: https://datasheet.ciiva.com/16940/pyu-rc0402-51-rohs-l-6-16940293.pdf?src-supplier=Avnet+Europe; ComponentLink2URL: https://datasheet.ciiva.com/28386/pyu-rc0402-51-rohs-l-6-28386855.pdf?src-supplier=Avnet+Europe; ComponentLink2Description: https://datasheet.ciiva.com/28386/pyu-rc0402-51-rohs-l-6-28386855.pdf?src-supplier=Avnet+Europe; ComponentLink3URL: https://datasheet.ciiva.com/16740/pyu-rc0402-51-rohs-l-6-r-16740602.pdf?src-supplier=Future+Electronics; ComponentLink3Description: https://datasheet.ciiva.com/16740/pyu-rc0402-51-rohs-l-6-r-16740602.pdf?src-supplier=Future+Electronics; ComponentLink4URL: https://datasheet.ciiva.com/8891/pyu-rc0402-51-rohs-l-6-8891339.pdf?src-supplier=Avnet; ComponentLink4Description: https://datasheet.ciiva.com/8891/pyu-rc0402-51-rohs-l-6-8891339.pdf?src-supplier=Avnet; ComponentLink5URL: https://datasheet.ciiva.com/5557/pyu-rc0402-51-rohs-l-6-r-5557997.pdf?src-supplier=Mouser; ComponentLink5Description: https://datasheet.ciiva.com/5557/pyu-rc0402-51-rohs-l-6-r-5557997.pdf?src-supplier=Mouser; ComponentLink6URL: https://datasheet.ciiva.com/7983/1018594-7983533.pdf?src-supplier=Element14; ComponentLink6Description: https://datasheet.ciiva.com/7983/1018594-7983533.pdf?src-supplier=Element14; Supplier 1: Newark; Manufacturer Part Number 1: RC0402FR-1310KL; Stock 1: 62239; Pricing 1: 1=0.10000, 25=0.01200, 100=0.00400, 250=0.00400, 500=0.00300, 1000=0.00300 (USD); RoHS: Yes; Case/Package: 0402; Number of Pins: 2; Contact Plating: Tin,Matte,Lead; Case Code (Imperial): 0402; Case Code (Metric): 1005; Min Operating Temperature: -55°C; Max Operating Temperature: 155°C; Tolerance: 1%; Composition: Thick Film; Packaging: Tape and Reel; Termination: SMD/SMT; Military Standard: Not; Voltage Rating (DC): 50V; Working Voltage: 50V; Number of Terminations: 2; Length: 1mm; Depth: 0.5mm; Radiation Hardening: No; REACH SVHC: No SVHC; Lead Free: Lead Free; Supplier Part Number 1: 67R9960; Supplier 2: Future Electronics; Supplier 3: Mouser; Supplier 4: Element14; Supplier Part Number 2: RC0402FR-1310KL-CUTT; Supplier Part Number 3: 603-RC0402FR-1310KL; Supplier Part Number 4: 1799235

## Sheet NG2092_MICS.SchDoc: =project_title
size Tabloid; PageSetup: Record=PageOptions|CenterHorizontal=True|CenterVertical=True|PrintScale=0.73|XCorrection=1.00|YCorrection=1.00|PrintKind=0|BorderSize=5000000|LeftOffset=0|BottomOffset=0|Orientation=2|PaperLength=1000|PaperWidth=1000|Scale=100|PaperSource=7|PrintQuality=-4|MediaType=1|DitherType=10|PaperKind=A4|PrintScaleMode=1; CompanyName: Luxonis Holding; DrawnBy: Nejc Gostincar; Organization: Luxonis Holding; Address1: 1925 Harmony Park Drive; Address2: Westminster, CO; Address3: 80234; Address4: United States; DocumentNumber: DXXXX; Revision: R0M0E0; SheetNumber: 8; SheetTotal: 12
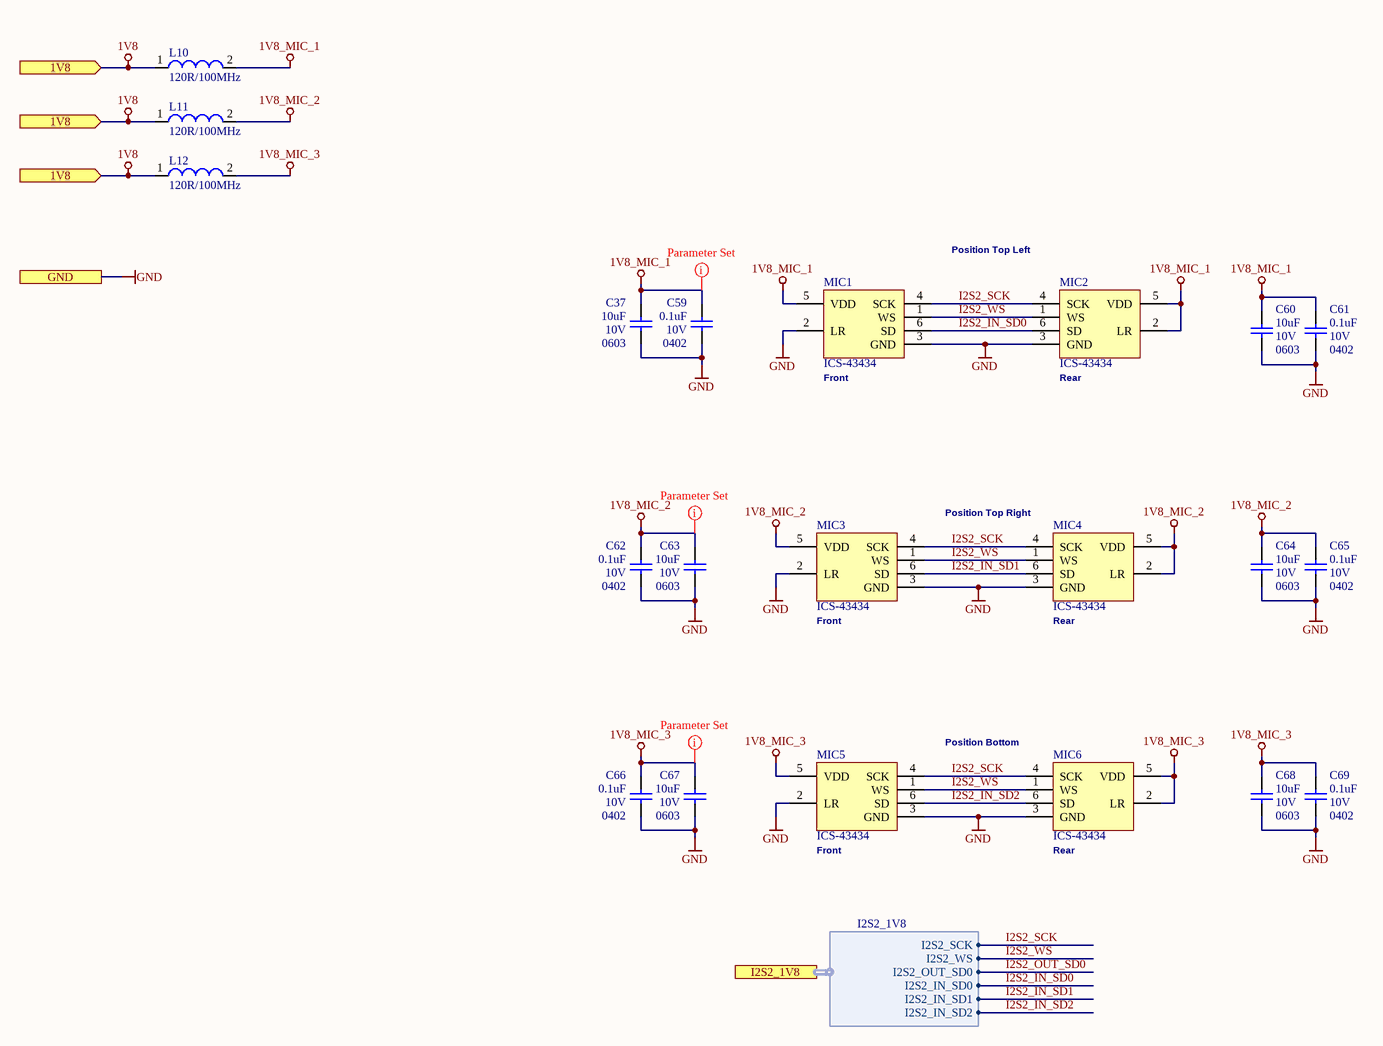
[diagram p13: NG2092_MICS.SchDoc]

### Parts
C37  Case Code (Imperial): 0603  Capacitance: 10uF  Voltage Rating: 10V  [CAPC0603(1608)100_L]  (hidden comment: 10uF 0603)
C59  Case/Package: 0402  Capacitance: 0.1uF  Voltage Rating: 10V  [CAPC0402(1005)70_L]  (hidden comment: 0.1uF 0402)
C60  Case Code (Imperial): 0603  Capacitance: 10uF  Voltage Rating: 10V  [CAPC0603(1608)100_L]  (hidden comment: 10uF 0603)
C61  Case/Package: 0402  Capacitance: 0.1uF  Voltage Rating: 10V  [CAPC0402(1005)70_L]  (hidden comment: 0.1uF 0402)
C62  Case/Package: 0402  Capacitance: 0.1uF  Voltage Rating: 10V  [CAPC0402(1005)70_L]  (hidden comment: 0.1uF 0402)
C63  Case Code (Imperial): 0603  Capacitance: 10uF  Voltage Rating: 10V  [CAPC0603(1608)100_L]  (hidden comment: 10uF 0603)
C64  Case Code (Imperial): 0603  Capacitance: 10uF  Voltage Rating: 10V  [CAPC0603(1608)100_L]  (hidden comment: 10uF 0603)
C65  Case/Package: 0402  Capacitance: 0.1uF  Voltage Rating: 10V  [CAPC0402(1005)70_L]  (hidden comment: 0.1uF 0402)
C66  Case/Package: 0402  Capacitance: 0.1uF  Voltage Rating: 10V  [CAPC0402(1005)70_L]  (hidden comment: 0.1uF 0402)
C67  Case Code (Imperial): 0603  Capacitance: 10uF  Voltage Rating: 10V  [CAPC0603(1608)100_L]  (hidden comment: 10uF 0603)
C68  Case Code (Imperial): 0603  Capacitance: 10uF  Voltage Rating: 10V  [CAPC0603(1608)100_L]  (hidden comment: 10uF 0603)
C69  Case/Package: 0402  Capacitance: 0.1uF  Voltage Rating: 10V  [CAPC0402(1005)70_L]  (hidden comment: 0.1uF 0402)
L10  120R/100MHz  [BLM18PG121SN1D_N]
L11  120R/100MHz  [BLM18PG121SN1D_N]
L12  120R/100MHz  [BLM18PG121SN1D_N]
MIC1  ICS-43434  [ICS-43434]
MIC2  ICS-43434  [ICS-43434]
MIC3  ICS-43434  [ICS-43434]
MIC4  ICS-43434  [ICS-43434]
MIC5  ICS-43434  [ICS-43434]
MIC6  ICS-43434  [ICS-43434]

### Ports
1V8 (in), GND, I2S2_1V8 (harness I2S2_1V8)

### Harnesses
I2S2_1V8: I2S2_SCK, I2S2_WS, I2S2_OUT_SD0, I2S2_IN_SD0, I2S2_IN_SD1, I2S2_IN_SD2

### Nets
1V8: L10.1 L11.1 L12.1 ; port 1V8
1V8_MIC_1: C37.2 C59.2 C60.2 C61.2 L10.2 MIC1.5(VDD) MIC2.2(LR) MIC2.5(VDD)
1V8_MIC_2: C62.2 C63.2 C64.2 C65.2 L11.2 MIC3.5(VDD) MIC4.2(LR) MIC4.5(VDD)
1V8_MIC_3: C66.2 C67.2 C68.2 C69.2 L12.2 MIC5.5(VDD) MIC6.2(LR) MIC6.5(VDD)
GND: C37.1 C59.1 C60.1 C61.1 C62.1 C63.1 C64.1 C65.1 C66.1 C67.1 C68.1 C69.1 MIC1.2(LR) MIC1.3(GND) MIC2.3(GND) MIC3.2(LR) MIC3.3(GND) MIC4.3(GND) MIC5.2(LR) MIC5.3(GND) MIC6.3(GND) ; port GND
I2S2_IN_SD0: MIC1.6(SD) MIC2.6(SD) ; port I2S2_1V8.I2S2_IN_SD0
I2S2_IN_SD1: MIC3.6(SD) MIC4.6(SD) ; port I2S2_1V8.I2S2_IN_SD1
I2S2_IN_SD2: MIC5.6(SD) MIC6.6(SD) ; port I2S2_1V8.I2S2_IN_SD2
I2S2_SCK: MIC1.4(SCK) MIC2.4(SCK) MIC3.4(SCK) MIC4.4(SCK) MIC5.4(SCK) MIC6.4(SCK) ; port I2S2_1V8.I2S2_SCK
I2S2_WS: MIC1.1(WS) MIC2.1(WS) MIC3.1(WS) MIC4.1(WS) MIC5.1(WS) MIC6.1(WS) ; port I2S2_1V8.I2S2_WS

### Layout directives
net class POWER: 1V8_MIC_1, 1V8_MIC_2, 1V8_MIC_3

### Notes on the sheet
- Position Top Left
- (near MIC1) Front
- (near MIC2) Rear
- Position Top Right
- (near MIC3) Front
- (near MIC4) Rear
- Position Bottom
- (near MIC5) Front
- (near MIC6) Rear
- Title
- Size:
- Date:
- Tabloid
- Number:
- Time:
- Revision:
- Sheet
- of
- Drawn by:

### Library data of the parts
C37 C60 C63 C64 C67 C68 = GRM188R61A106ME69D: CAP CER 10UF 10V X5R 0603 20%; Manufacturer 1: Murata; Material: Ceramic; Supplier 1: Digi-Key; Manufacturer Part Number 1: GRM188R61A106ME69D; Stock 1: 2873098; Pricing 1: 1=0.21000, 10=0.14100, 100=0.07130, 500=0.04876, 1000=0.04313 (USD); RoHS: Yes; Mount: Surface Mount; Case/Package: 0603; Weight: 0.000222oz; Case Code (Metric): 1608; Min Operating Temperature: -55°C; Max Operating Temperature: 85°C; Packaging: Tape and Reel; Tolerance: 20%; Dielectric: X5R; Voltage Rating (DC): 10V; Package Quantity: 4000; Termination: SMD/SMT; Length: 1.6mm; Height: 0.8mm; Width: 0.8mm; Thickness: 0.035inch; Depth: 0.8mm; REACH SVHC: Unknown; Lead Free: Lead Free; ComponentLink1URL: http://www.mouser.com/ds/2/281/c02e-2905.pdf?src-supplier=Mouser; ComponentLink1Description: http://www.mouser.com/ds/2/281/c02e-2905.pdf?src-supplier=Mouser; ComponentLink2URL: http://components.arrow.com/part/dataview/0323_06119472?src-supplier=Arrow+Europe; ComponentLink2Description: http://components.arrow.com/part/dataview/0323_06119472?src-supplier=Arrow+Europe; ComponentLink3URL: http://www.farnell.com/datasheets/2048014.pdf?src-supplier=Farnell; ComponentLink3Description: http://www.farnell.com/datasheets/2048014.pdf?src-supplier=Farnell; ComponentLink4URL: http://www.farnell.com/datasheets/1872210.pdf?src-supplier=Farnell; ComponentLink4Description: http://www.farnell.com/datasheets/1872210.pdf?src-supplier=Farnell; ComponentLink5URL: http://search.murata.co.jp/Ceramy/image/img/A01X/G101/ENG/GRM188R61A106ME69-01.pdf?src-supplier=Digi-Key; ComponentLink5Description: http://search.murata.co.jp/Ceramy/image/img/A01X/G101/ENG/GRM188R61A106ME69-01.pdf?src-supplier=Digi-Key; ComponentLink6URL: http://www.farnell.com/datasheets/1872210.pdf?src-supplier=Newark; ComponentLink6Description: http://www.farnell.com/datasheets/1872210.pdf?src-supplier=Newark; ComponentLink7URL: http://www.farnell.com/datasheets/2048014.pdf?src-supplier=Element14; ComponentLink7Description: http://www.farnell.com/datasheets/2048014.pdf?src-supplier=Element14; ComponentLink8URL: http://www.farnell.com/datasheets/2048014.pdf?src-supplier=Newark; ComponentLink8Description: http://www.farnell.com/datasheets/2048014.pdf?src-supplier=Newark; Supplier Part Number 1: 490-10475-1-ND
C59 C61 C62 C65 C66 C69 = GRM155R71A104JA01D: CAP CER 0.1UF 10V X7R 0402 5%; Manufacturer 1: Murata; Supplier 1: Digi-Key; Manufacturer Part Number 1: GRM155R71A104JA01D; Stock 1: 1346709; Pricing 1: 1=0.10000, 10=0.02500, 100=0.01130, 500=0.00806, 1000=0.00633, 2500=0.00575, 5000=0.00529 (USD); RoHS: Yes; Mount: Surface Mount; Case Code (Imperial): 0402; Case Code (Metric): 1005; Min Operating Temperature: -55°C; Max Operating Temperature: 125°C; Tolerance: 5%; Packaging: Tape and Reel; Voltage Rating (DC): 10V; Dielectric: X7R; Package Quantity: 10000; Termination: SMD/SMT; Length: 1mm; Height: 0.5mm; Width: 0.02inch; Thickness: 0.022inch; Depth: 0.5mm; Radiation Hardening: No; Lead Free: Lead Free; ComponentLink1URL: https://datasheet.ciiva.com/5411/product-5411135.pdf?src-supplier=Mouser; ComponentLink1Description: https://datasheet.ciiva.com/5411/product-5411135.pdf?src-supplier=Mouser; ComponentLink2URL: https://datasheet.ciiva.com/11618/c02e-11618821.pdf?src-supplier=Avnet; ComponentLink2Description: https://datasheet.ciiva.com/11618/c02e-11618821.pdf?src-supplier=Avnet; Supplier Part Number 1: 490-10777-1-ND
L10-L12 = BLM18PG121SN1D: FERRITE BEAD 120 OHM 0603 1LN; Manufacturer 1: Murata; Material: Steel,Ferrite; Tolerance: 25%; Impedance: 120R; DC Resistance (DCR): 50mR; Max DC Current: 2A; Number of Lines: 1; Test Frequency: 100MHz; Shielding: Unshielded; Supplier 1: Digi-Key; Manufacturer Part Number 1: BLM18PG121SN1D; Stock 1: 377829; Pricing 1: 1=0.10000, 10=0.07600, 25=0.06840, 50=0.05000, 100=0.04330, 250=0.03416, 500=0.02884, 1000=0.02429 (USD); RoHS: Yes; Case/Package: 0603; Number of Pins: 2; Core Material: Ferrite; Case Code (Metric): 1608; Case Code (Imperial): 0603; Min Operating Temperature: -55°C; Max Operating Temperature: 125°C; Package Quantity: 1; Max Current Rating: 2A; Packaging: Tape and Reel; Current Rating: 2A; Termination: SMD/SMT; DC Current: 2A; Frequency: 100MHz; Number of Circuits: 1; Length: 1.6mm; Height: 0.8mm; Width: 0.8mm; Depth: 0.8mm; Radiation Hardening: No; REACH SVHC: No SVHC; Lead Free: Lead Free; ComponentLink1URL: https://datasheet.ciiva.com/5709/1740433-5709171.pdf?src-supplier=Farnell; ComponentLink1Description: https://datasheet.ciiva.com/5709/1740433-5709171.pdf?src-supplier=Farnell; ComponentLink2URL: https://datasheet.ciiva.com/3854/5emiapbde-1-3854039.pdf?src-supplier=Arrow; ComponentLink2Description: https://datasheet.ciiva.com/3854/5emiapbde-1-3854039.pdf?src-supplier=Arrow; ComponentLink3URL: https://datasheet.ciiva.com/11799/0900766b81275ca5-11799546.pdf?src-supplier=RSComponents; ComponentLink3Description: https://datasheet.ciiva.com/11799/0900766b81275ca5-11799546.pdf?src-supplier=RSComponents; ComponentLink4URL: https://datasheet.ciiva.com/19454/1845013-19454715.pdf?src-supplier=Jameco; ComponentLink4Description: https://datasheet.ciiva.com/19454/1845013-19454715.pdf?src-supplier=Jameco; ComponentLink5URL: https://datasheet.ciiva.com/29347/442365-da-01-en-chip-drossel-0603-120r-2000ma-1-6x0-8mm-29347911.pdf?src-supplier=Conrad; ComponentLink5Description: https://datasheet.ciiva.com/29347/442365-da-01-en-chip-drossel-0603-120r-2000ma-1-6x0-8mm-29347911.pdf?src-supplier=Conrad; ComponentLink6URL: https://datasheet.ciiva.com/3081/l0110s0100blm18p-3081632.pdf?src-supplier=Avnet; ComponentLink6Description: https://datasheet.ciiva.com/3081/l0110s0100blm18p-3081632.pdf?src-supplier=Avnet; ComponentLink7URL: https://datasheet.ciiva.com/8021/1740433-8021493.pdf?src-supplier=Element14; ComponentLink7Description: https://datasheet.ciiva.com/8021/1740433-8021493.pdf?src-supplier=Element14; ComponentLink8URL: https://datasheet.ciiva.com/6212/l0110s0100blm18p-6212502.pdf?src-supplier=Digi-Key; ComponentLink8Description: https://datasheet.ciiva.com/6212/l0110s0100blm18p-6212502.pdf?src-supplier=Digi-Key; ComponentLink9URL: https://datasheet.ciiva.com/8021/1740433-8021494.pdf?src-supplier=Element14; ComponentLink9Description: https://datasheet.ciiva.com/8021/1740433-8021494.pdf?src-supplier=Element14; ComponentLink10URL: https://datasheet.ciiva.com/6212/l0110s0100blm18p-6212504.pdf?src-supplier=Digi-Key; ComponentLink10Description: https://datasheet.ciiva.com/6212/l0110s0100blm18p-6212504.pdf?src-supplier=Digi-Key; ComponentLink11URL: https://datasheet.ciiva.com/14122/blm-series-eng-tds-14122905.pdf?src-supplier=Distrelec; ComponentLink11Description: https://datasheet.ciiva.com/14122/blm-series-eng-tds-14122905.pdf?src-supplier=Distrelec; ComponentLink12URL: https://datasheet.ciiva.com/25903/l0110s0100blm18p-25903483.pdf?src-supplier=Avnet+Europe; ComponentLink12Description: https://datasheet.ciiva.com/25903/l0110s0100blm18p-25903483.pdf?src-supplier=Avnet+Europe; ComponentLink13URL: https://datasheet.ciiva.com/41449/001172297-da-01-en-drossel-0603-120r-1-6x0-8mm-4000st-41449659.pdf?src-supplier=Conrad; ComponentLink13Description: https://datasheet.ciiva.com/41449/001172297-da-01-en-drossel-0603-120r-1-6x0-8mm-4000st-41449659.pdf?src-supplier=Conrad; Supplier 2: Mouser; Supplier 3: Newark; Supplier Part Number 1: 490-1037-1-ND; Supplier Part Number 2: 81-BLM18PG121SN1D; Supplier Part Number 3: 73M9109
MIC1-MIC6 = ICS-43434: 60Hz ~ 20kHz Digital, I2S Microphone MEMS _Silicon_ 1.65V ~ 3.63V Omnidirectional _-26 ±1dB @ 94dB SPL_ Solder Pads; Manufacturer 1: TDK InvenSense; Consumer IC Type: CONSUMER CIRCUIT; Supplier 1: Digi-Key; RoHS: No; Category: Microphones; REACH SVHC: No SVHC; RoHS Compliant: No; ComponentLink1URL: https://datasheet.ciiva.com:443/pdfs/VipMasterIC/IC/IVNC/IVNC-S-A0005715430/IVNC-S-A0005715430-1.pdf?src-supplier=IHS+Markit; ComponentLink1Description: https://datasheet.ciiva.com:443/pdfs/VipMasterIC/IC/IVNC/IVNC-S-A0005715430/IVNC-S-A0005715430-1.pdf?src-supplier=IHS+Markit; ComponentLink2URL: http://www.farnell.com/datasheets/2632666.pdf?src-supplier=Farnell; ComponentLink2Description: http://www.farnell.com/datasheets/2632666.pdf?src-supplier=Farnell; ComponentLink3URL: https://www.invensense.com/wp-content/uploads/2016/02/PB-000018-ICS-43434-v1.1.pdf?src-supplier=Digi-Key; ComponentLink3Description: https://www.invensense.com/wp-content/uploads/2016/02/PB-000018-ICS-43434-v1.1.pdf?src-supplier=Digi-Key; ComponentLink4URL: http://www.farnell.com/datasheets/2632666.pdf?src-supplier=Element14; ComponentLink4Description: http://www.farnell.com/datasheets/2632666.pdf?src-supplier=Element14; ComponentLink5URL: https://www.invensense.com/wp-content/uploads/2016/02/DS-000069-ICS-43434-v1.2.pdf?src-supplier=Digi-Key; ComponentLink5Description: https://www.invensense.com/wp-content/uploads/2016/02/DS-000069-ICS-43434-v1.2.pdf?src-supplier=Digi-Key; ComponentLink6URL: http://www.farnell.com/datasheets/2632666.pdf?src-supplier=Newark; ComponentLink6Description: http://www.farnell.com/datasheets/2632666.pdf?src-supplier=Newark; Supplier Part Number 1: 1428-1066-1-ND; Manufacturer Part Number 1: ICS-43434; Stock 1: 38549; Pricing 1: 1=2,62000, 10=2,16800, 25=2,00160, 50=1,88080, 100=1,76430, 500=1,52950 (USD)